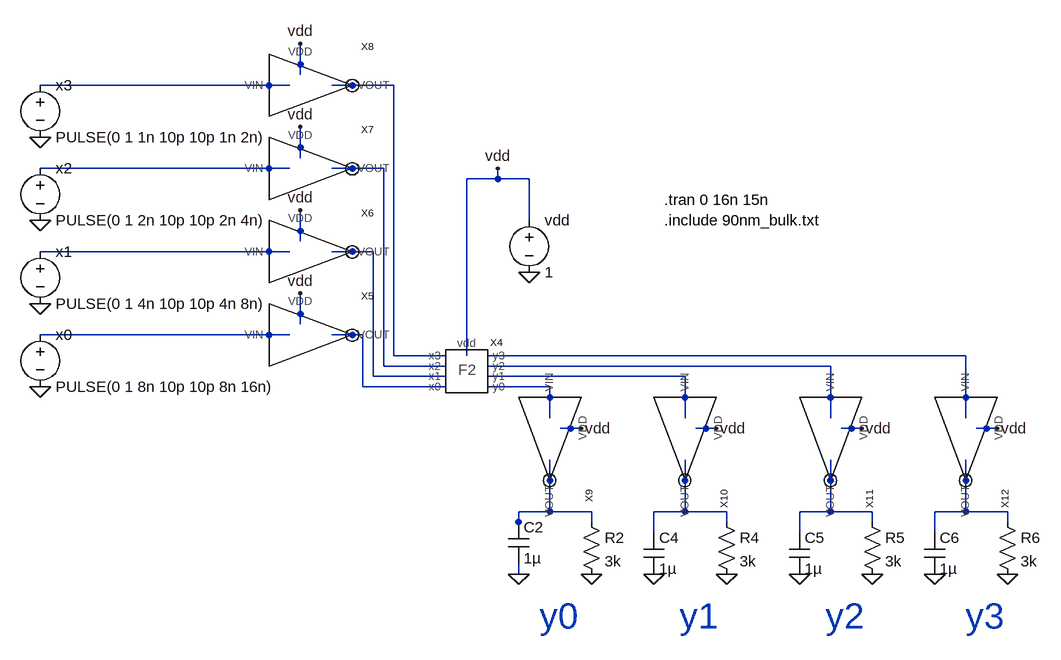
[diagram p0: schematic Formula2-test.asc]
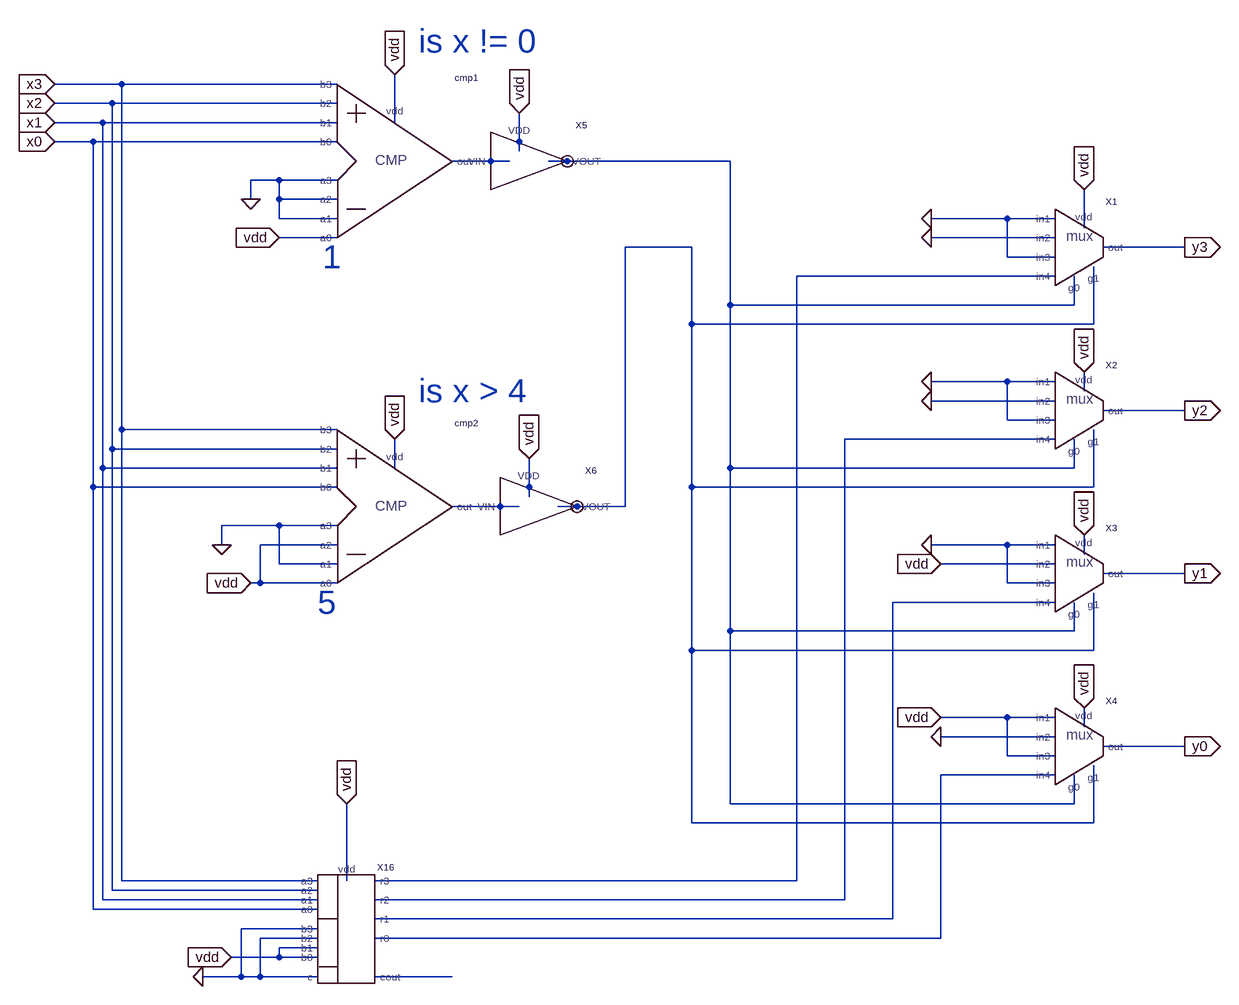
[diagram p1: sub-circuit formula2.asc]
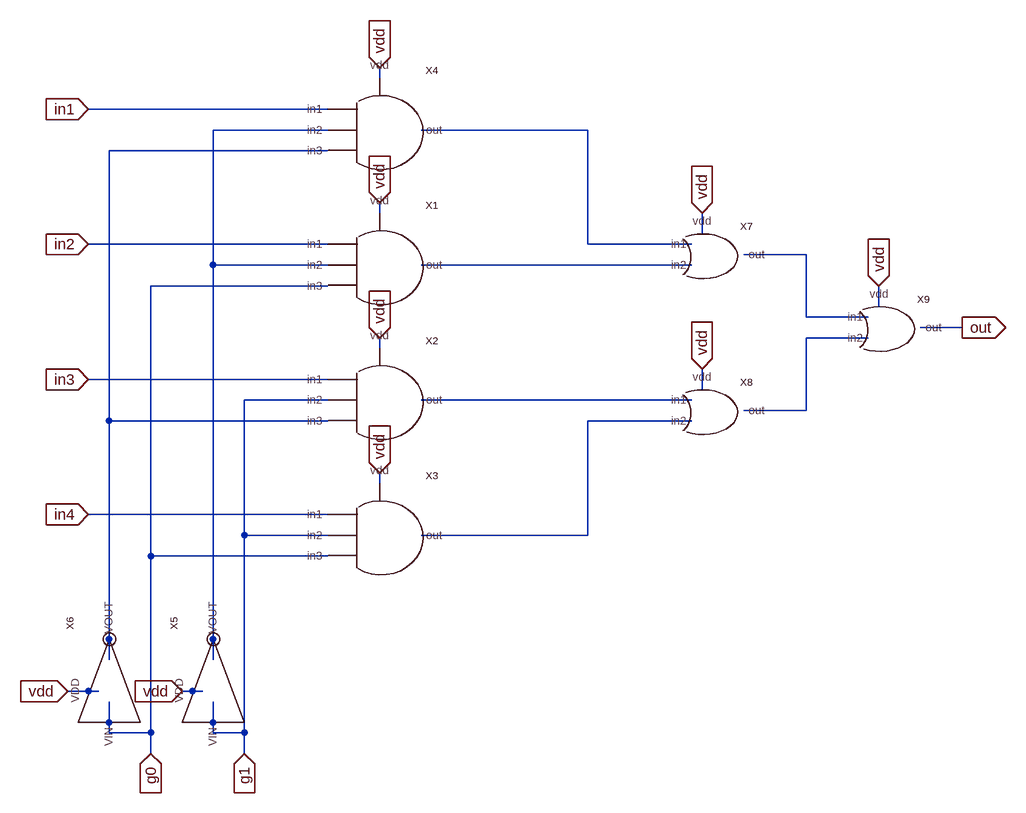
[diagram p2: sub-circuit mux4.asc]
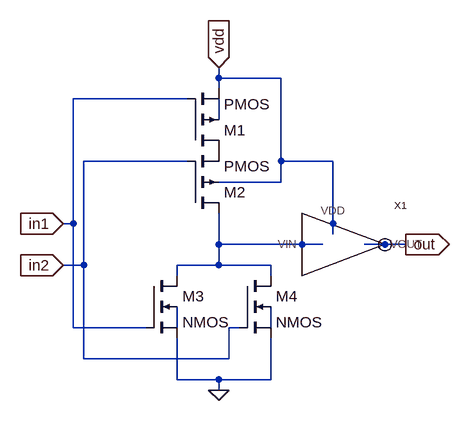
[diagram p3: sub-circuit or.asc]
Formula2-test.asc, the LTspice schematic file:
Version 4
SHEET 1 4228 1348
WIRE -112 -208 -112 -256
WIRE -128 -192 -512 -192
WIRE 32 -192 -64 -192
WIRE -112 -80 -112 -128
WIRE -128 -64 -512 -64
WIRE 16 -64 -64 -64
WIRE 192 -48 192 -64
WIRE 192 -48 144 -48
WIRE 240 -48 192 -48
WIRE 240 16 240 -48
WIRE -112 48 -112 0
WIRE -128 64 -512 64
WIRE 0 64 -64 64
WIRE -112 176 -112 128
WIRE -128 192 -512 192
WIRE -16 192 -64 192
WIRE 32 224 32 -192
WIRE 112 224 32 224
WIRE 144 224 144 -48
WIRE 912 224 176 224
WIRE 16 240 16 -64
WIRE 112 240 16 240
WIRE 704 240 176 240
WIRE 0 256 0 64
WIRE 112 256 0 256
WIRE 480 256 176 256
WIRE -16 272 -16 192
WIRE 112 272 -16 272
WIRE 272 272 176 272
WIRE 272 320 272 272
WIRE 480 320 480 256
WIRE 704 320 704 240
WIRE 912 320 912 224
WIRE 320 336 288 336
WIRE 528 336 496 336
WIRE 752 336 720 336
WIRE 960 336 928 336
WIRE 272 464 272 384
WIRE 272 464 224 464
WIRE 336 464 272 464
WIRE 480 464 480 384
WIRE 480 464 432 464
WIRE 544 464 480 464
WIRE 704 464 704 384
WIRE 704 464 656 464
WIRE 768 464 704 464
WIRE 912 464 912 384
WIRE 912 464 864 464
WIRE 976 464 912 464
WIRE 224 480 224 464
WIRE 336 480 336 464
WIRE 544 480 544 464
WIRE 768 480 768 464
WIRE 976 480 976 464
WIRE 224 496 224 480
WIRE 432 496 432 464
WIRE 656 496 656 464
WIRE 864 496 864 464
WIRE 224 560 224 544
FLAG -512 144 0
FLAG -512 272 0
FLAG -512 16 0
FLAG -512 -112 0
FLAG 224 560 0
FLAG 336 560 0
FLAG 432 560 0
FLAG 544 560 0
FLAG 656 560 0
FLAG 768 560 0
FLAG 864 560 0
FLAG 976 560 0
FLAG 240 96 0
FLAG 192 -64 vdd
FLAG -112 -256 vdd
FLAG -112 -128 vdd
FLAG -112 0 vdd
FLAG -112 128 vdd
FLAG 320 336 vdd
FLAG 528 336 vdd
FLAG 752 336 vdd
FLAG 960 336 vdd
SYMBOL voltage -512 176 R0
WINDOW 123 0 0 Left 2
WINDOW 39 0 0 Left 2
SYMATTR InstName x0
SYMATTR Value PULSE(0 1 8n 10p 10p 8n 16n)
SYMBOL voltage -512 48 R0
WINDOW 123 0 0 Left 2
WINDOW 39 0 0 Left 2
SYMATTR InstName x1
SYMATTR Value PULSE(0 1 4n 10p 10p 4n 8n)
SYMBOL voltage -512 -80 R0
WINDOW 123 0 0 Left 2
WINDOW 39 0 0 Left 2
SYMATTR InstName x2
SYMATTR Value PULSE(0 1 2n 10p 10p 2n 4n)
SYMBOL voltage -512 -208 R0
WINDOW 123 0 0 Left 2
WINDOW 39 0 0 Left 2
SYMATTR InstName x3
SYMATTR Value PULSE(0 1 1n 10p 10p 1n 2n)
SYMBOL voltage 240 0 R0
WINDOW 123 0 0 Left 2
WINDOW 39 0 0 Left 2
SYMATTR InstName vdd
SYMATTR Value 1
SYMBOL res 320 464 R0
SYMATTR InstName R2
SYMATTR Value 3k
SYMBOL cap 208 480 R0
SYMATTR InstName C2
SYMATTR Value 1µ
SYMBOL res 528 464 R0
SYMATTR InstName R4
SYMATTR Value 3k
SYMBOL cap 416 496 R0
SYMATTR InstName C4
SYMATTR Value 1µ
SYMBOL res 752 464 R0
SYMATTR InstName R5
SYMATTR Value 3k
SYMBOL cap 640 496 R0
SYMATTR InstName C5
SYMATTR Value 1µ
SYMBOL res 960 464 R0
SYMATTR InstName R6
SYMATTR Value 3k
SYMBOL cap 848 496 R0
SYMATTR InstName C6
SYMATTR Value 1µ
SYMBOL Formula2 144 240 R0
SYMATTR InstName X4
SYMBOL inverter -112 192 R0
SYMATTR InstName X5
SYMBOL inverter -112 64 R0
SYMATTR InstName X6
SYMBOL inverter -112 -64 R0
SYMATTR InstName X7
SYMBOL inverter -112 -192 R0
SYMATTR InstName X8
SYMBOL inverter 272 336 R90
SYMATTR InstName X9
SYMBOL inverter 480 336 R90
SYMATTR InstName X10
SYMBOL inverter 704 336 R90
SYMATTR InstName X11
SYMBOL inverter 912 336 R90
SYMATTR InstName X12
TEXT 448 16 Left 2 !.include 90nm_bulk.txt
TEXT 448 -16 Left 2 !.tran 0 16n 15n
TEXT 256 624 Left 5 ;y0
TEXT 472 624 Left 5 ;y1
TEXT 696 624 Left 5 ;y2
TEXT 912 624 Left 5 ;y3

formula2.asc, the sub-circuit schematic file:
Version 4
SHEET 1 880 680
WIRE -4432 -2016 -4544 -2016
WIRE -3920 -2016 -4432 -2016
WIRE -4448 -1984 -4544 -1984
WIRE -3920 -1984 -4448 -1984
WIRE -4464 -1952 -4544 -1952
WIRE -3920 -1952 -4464 -1952
WIRE -3824 -1952 -3824 -2032
WIRE -4480 -1920 -4544 -1920
WIRE -3920 -1920 -4480 -1920
WIRE -3616 -1904 -3616 -1968
WIRE -3632 -1888 -3728 -1888
WIRE -2800 -1888 -3568 -1888
WIRE -4016 -1856 -4064 -1856
WIRE -3920 -1856 -4016 -1856
WIRE -4064 -1824 -4064 -1856
WIRE -4016 -1824 -4016 -1856
WIRE -3920 -1824 -4016 -1824
WIRE -4016 -1792 -4016 -1824
WIRE -3920 -1792 -4016 -1792
WIRE -1888 -1792 -2208 -1792
WIRE -1808 -1792 -1888 -1792
WIRE -1760 -1776 -1760 -1840
WIRE -3920 -1760 -4016 -1760
WIRE -1808 -1760 -2208 -1760
WIRE -2864 -1744 -3440 -1744
WIRE -1152 -1744 -1728 -1744
WIRE -1888 -1728 -1888 -1792
WIRE -1808 -1728 -1888 -1728
WIRE -1808 -1696 -2432 -1696
WIRE -2800 -1648 -2800 -1888
WIRE -1776 -1648 -1776 -1696
WIRE -1776 -1648 -2800 -1648
WIRE -2864 -1616 -2864 -1744
WIRE -1744 -1616 -1744 -1712
WIRE -1744 -1616 -2864 -1616
WIRE -1888 -1520 -2208 -1520
WIRE -1808 -1520 -1888 -1520
WIRE -1760 -1504 -1760 -1536
WIRE -1808 -1488 -2208 -1488
WIRE -1152 -1472 -1728 -1472
WIRE -1888 -1456 -1888 -1520
WIRE -1808 -1456 -1888 -1456
WIRE -4432 -1440 -4432 -2016
WIRE -3920 -1440 -4432 -1440
WIRE -1808 -1424 -2352 -1424
WIRE -4448 -1408 -4448 -1984
WIRE -3920 -1408 -4448 -1408
WIRE -4464 -1376 -4464 -1952
WIRE -3920 -1376 -4464 -1376
WIRE -3824 -1376 -3824 -1424
WIRE -2800 -1376 -2800 -1648
WIRE -1776 -1376 -1776 -1424
WIRE -1776 -1376 -2800 -1376
WIRE -4480 -1344 -4480 -1920
WIRE -3920 -1344 -4480 -1344
WIRE -2864 -1344 -2864 -1616
WIRE -1744 -1344 -1744 -1440
WIRE -1744 -1344 -2864 -1344
WIRE -3600 -1328 -3600 -1392
WIRE -3616 -1312 -3728 -1312
WIRE -3440 -1312 -3440 -1744
WIRE -3440 -1312 -3552 -1312
WIRE -4016 -1280 -4112 -1280
WIRE -3920 -1280 -4016 -1280
WIRE -4112 -1248 -4112 -1280
WIRE -3920 -1248 -4048 -1248
WIRE -1888 -1248 -2208 -1248
WIRE -1808 -1248 -1888 -1248
WIRE -1760 -1232 -1760 -1264
WIRE -4016 -1216 -4016 -1280
WIRE -3920 -1216 -4016 -1216
WIRE -1808 -1216 -2192 -1216
WIRE -1152 -1200 -1728 -1200
WIRE -4048 -1184 -4048 -1248
WIRE -4048 -1184 -4064 -1184
WIRE -3920 -1184 -4048 -1184
WIRE -1888 -1184 -1888 -1248
WIRE -1808 -1184 -1888 -1184
WIRE -1808 -1152 -2272 -1152
WIRE -2800 -1104 -2800 -1376
WIRE -1776 -1104 -1776 -1152
WIRE -1776 -1104 -2800 -1104
WIRE -2864 -1072 -2864 -1344
WIRE -1744 -1072 -1744 -1168
WIRE -1744 -1072 -2864 -1072
WIRE -1888 -960 -2192 -960
WIRE -1808 -960 -1888 -960
WIRE -1760 -944 -1760 -976
WIRE -1808 -928 -2192 -928
WIRE -1152 -912 -1728 -912
WIRE -1888 -896 -1888 -960
WIRE -1808 -896 -1888 -896
WIRE -1808 -864 -2192 -864
WIRE -2800 -816 -2800 -1104
WIRE -1776 -816 -1776 -864
WIRE -1776 -816 -2800 -816
WIRE -2864 -784 -2864 -1072
WIRE -1744 -784 -1744 -880
WIRE -1744 -784 -2864 -784
WIRE -4432 -688 -4432 -1440
WIRE -3952 -688 -4432 -688
WIRE -3904 -688 -3904 -816
WIRE -2432 -688 -2432 -1696
WIRE -2432 -688 -3856 -688
WIRE -4448 -672 -4448 -1408
WIRE -3952 -672 -4448 -672
WIRE -4464 -656 -4464 -1376
WIRE -3952 -656 -4464 -656
WIRE -2352 -656 -2352 -1424
WIRE -2352 -656 -3856 -656
WIRE -4480 -640 -4480 -1344
WIRE -3952 -640 -4480 -640
WIRE -2272 -624 -2272 -1152
WIRE -2272 -624 -3856 -624
WIRE -3952 -608 -4080 -608
WIRE -3952 -592 -4048 -592
WIRE -2192 -592 -2192 -864
WIRE -2192 -592 -3856 -592
WIRE -3952 -576 -4016 -576
WIRE -4016 -560 -4016 -576
WIRE -4016 -560 -4096 -560
WIRE -3952 -560 -4016 -560
WIRE -4080 -528 -4080 -608
WIRE -4080 -528 -4144 -528
WIRE -4048 -528 -4048 -592
WIRE -4048 -528 -4080 -528
WIRE -3952 -528 -4048 -528
WIRE -3728 -528 -3856 -528
FLAG -4064 -1824 0
FLAG -4112 -1248 0
FLAG -4144 -528 0
FLAG -4544 -1920 x0
IOPIN -4544 -1920 In
FLAG -4544 -1952 x1
IOPIN -4544 -1952 In
FLAG -4544 -1984 x2
IOPIN -4544 -1984 In
FLAG -4544 -2016 x3
IOPIN -4544 -2016 In
FLAG -3824 -2032 vdd
IOPIN -3824 -2032 In
FLAG -4064 -1184 vdd
IOPIN -4064 -1184 In
FLAG -3904 -816 vdd
IOPIN -3904 -816 In
FLAG -4016 -1760 vdd
IOPIN -4016 -1760 In
FLAG -1152 -1744 y3
IOPIN -1152 -1744 Out
FLAG -1152 -1472 y2
IOPIN -1152 -1472 Out
FLAG -1152 -1200 y1
IOPIN -1152 -1200 Out
FLAG -1152 -912 y0
IOPIN -1152 -912 Out
FLAG -3824 -1424 vdd
IOPIN -3824 -1424 In
FLAG -4096 -560 vdd
IOPIN -4096 -560 In
FLAG -2192 -960 vdd
IOPIN -2192 -960 In
FLAG -2208 -1248 0
FLAG -2208 -1520 0
FLAG -2208 -1792 0
FLAG -2192 -1216 vdd
IOPIN -2192 -1216 In
FLAG -2192 -928 0
FLAG -2208 -1760 0
FLAG -2208 -1488 0
FLAG -3600 -1392 vdd
IOPIN -3600 -1392 In
FLAG -3616 -1968 vdd
IOPIN -3616 -1968 In
FLAG -1760 -1840 vdd
IOPIN -1760 -1840 In
FLAG -1760 -1536 vdd
IOPIN -1760 -1536 In
FLAG -1760 -1264 vdd
IOPIN -1760 -1264 In
FLAG -1760 -976 vdd
IOPIN -1760 -976 In
SYMBOL comparator -3856 -1888 R0
SYMATTR InstName cmp1
SYMBOL comparator -3856 -1312 R0
SYMATTR InstName cmp2
SYMBOL 4bitAdder -3904 -624 R0
SYMATTR InstName X16
SYMBOL mux4 -1760 -1744 R0
SYMATTR InstName X1
SYMBOL mux4 -1760 -1472 R0
SYMATTR InstName X2
SYMBOL mux4 -1760 -1200 R0
SYMATTR InstName X3
SYMBOL mux4 -1760 -912 R0
SYMATTR InstName X4
SYMBOL inverter -3616 -1888 R0
SYMATTR InstName X5
SYMBOL inverter -3600 -1312 R0
SYMATTR InstName X6
TEXT -3944 -1728 Left 5 ;1
TEXT -3952 -1152 Left 5 ;5
TEXT -3784 -2088 Left 5 ;is x != 0
TEXT -3784 -1504 Left 5 ;is x > 4

mux4.asc, the sub-circuit schematic file:
Version 4
SHEET 1 1428 876
WIRE 432 -256 432 -272
WIRE 352 -208 -16 -208
WIRE 352 -176 176 -176
WIRE 752 -176 496 -176
WIRE 352 -144 16 -144
WIRE 432 -48 432 -64
WIRE 928 -16 928 -48
WIRE 352 0 -16 0
WIRE 752 0 752 -176
WIRE 912 0 752 0
WIRE 1088 16 992 16
WIRE 176 32 176 -176
WIRE 352 32 176 32
WIRE 912 32 496 32
WIRE 352 64 80 64
WIRE 1200 96 1200 64
WIRE 1088 112 1088 16
WIRE 1184 112 1088 112
WIRE 1328 128 1264 128
WIRE 1184 144 1088 144
WIRE 432 160 432 144
WIRE 352 208 -16 208
WIRE 928 224 928 192
WIRE 352 240 224 240
WIRE 912 240 496 240
WIRE 1088 256 1088 144
WIRE 1088 256 992 256
WIRE 16 272 16 -144
WIRE 352 272 16 272
WIRE 912 272 752 272
WIRE 432 368 432 352
WIRE 352 416 -16 416
WIRE 224 448 224 240
WIRE 352 448 224 448
WIRE 752 448 752 272
WIRE 752 448 496 448
WIRE 80 480 80 64
WIRE 352 480 80 480
WIRE 16 640 16 272
WIRE 176 640 176 32
WIRE 0 688 -48 688
WIRE 160 688 128 688
WIRE 16 752 16 704
WIRE 80 752 80 480
WIRE 80 752 16 752
WIRE 176 752 176 704
WIRE 224 752 224 448
WIRE 224 752 176 752
WIRE 80 784 80 752
WIRE 224 784 224 752
FLAG -16 -208 in1
IOPIN -16 -208 In
FLAG -16 0 in2
IOPIN -16 0 In
FLAG -16 208 in3
IOPIN -16 208 In
FLAG -16 416 in4
IOPIN -16 416 In
FLAG 80 784 g0
IOPIN 80 784 In
FLAG 224 784 g1
IOPIN 224 784 In
FLAG -48 688 vdd
IOPIN -48 688 In
FLAG 128 688 vdd
IOPIN 128 688 In
FLAG 432 352 vdd
IOPIN 432 352 In
FLAG 432 144 vdd
IOPIN 432 144 In
FLAG 432 -64 vdd
IOPIN 432 -64 In
FLAG 432 -272 vdd
IOPIN 432 -272 In
FLAG 928 192 vdd
IOPIN 928 192 In
FLAG 928 -48 vdd
IOPIN 928 -48 In
FLAG 1200 64 vdd
IOPIN 1200 64 In
FLAG 1328 128 out
IOPIN 1328 128 Out
SYMBOL and3 432 32 R0
SYMATTR InstName X1
SYMBOL and3 432 240 R0
SYMATTR InstName X2
SYMBOL and3 432 -176 R0
SYMATTR InstName X4
SYMBOL inverter 176 688 R270
SYMATTR InstName X5
SYMBOL inverter 16 688 R270
SYMATTR InstName X6
SYMBOL and3 432 448 R0
SYMATTR InstName X3
SYMBOL or 928 16 R0
SYMATTR InstName X7
SYMBOL or 928 256 R0
SYMATTR InstName X8
SYMBOL or 1200 128 R0
SYMATTR InstName X9

or.asc, the sub-circuit schematic file:
Version 4
SHEET 1 880 680
WIRE 288 -128 288 -144
WIRE 384 -128 288 -128
WIRE 288 -112 288 -128
WIRE 240 -96 64 -96
WIRE 288 -64 288 -96
WIRE 240 0 80 0
WIRE 384 0 384 -128
WIRE 464 0 384 0
WIRE 384 32 384 0
WIRE 384 32 288 32
WIRE 64 96 64 -96
WIRE 64 96 48 96
WIRE 464 112 464 0
WIRE 288 128 288 80
WIRE 448 128 288 128
WIRE 576 128 512 128
WIRE 80 160 80 0
WIRE 80 160 48 160
WIRE 288 160 288 128
WIRE 288 160 224 160
WIRE 368 160 288 160
WIRE 224 176 224 160
WIRE 368 176 368 160
WIRE 64 256 64 96
WIRE 176 256 64 256
WIRE 224 256 224 224
WIRE 320 256 304 256
WIRE 368 256 368 224
WIRE 80 304 80 160
WIRE 304 304 304 256
WIRE 304 304 80 304
WIRE 224 336 224 272
WIRE 288 336 224 336
WIRE 368 336 368 272
WIRE 368 336 288 336
WIRE 288 352 288 336
FLAG 48 96 in1
IOPIN 48 96 In
FLAG 48 160 in2
IOPIN 48 160 In
FLAG 576 128 out
IOPIN 576 128 Out
FLAG 288 -144 vdd
IOPIN 288 -144 In
FLAG 288 352 0
SYMBOL pmos4 240 -16 M180
SYMATTR InstName M1
SYMATTR Value2 l=90n w=400n
SYMBOL pmos4 240 80 M180
SYMATTR InstName M2
SYMATTR Value2 l=90n w=400n
SYMBOL nmos4 176 176 R0
SYMATTR InstName M3
SYMATTR Value2 l=90n w=200n
SYMBOL nmos4 320 176 R0
SYMATTR InstName M4
SYMATTR Value2 l=90n w=200n
SYMBOL inverter 464 128 R0
SYMATTR InstName X1

The netlist it stands for:
* Formula2-test.asc
V§x0 N007 0 PULSE(0 1 8n 10p 10p 8n 16n)
V§x1 N005 0 PULSE(0 1 4n 10p 10p 4n 8n)
V§x2 N003 0 PULSE(0 1 2n 10p 10p 2n 4n)
V§x3 N001 0 PULSE(0 1 1n 10p 10p 1n 2n)
vdd vdd 0 1
R2 N013 0 3k
C2 N013 0 1µ
R4 N014 0 3k
C4 N014 0 1µ
R5 N015 0 3k
C5 N015 0 1µ
R6 N016 0 3k
C6 N016 0 1µ
XX4 N008 N006 N004 N002 vdd N012 N011 N010 N009 formula2
XX5 vdd N008 N007 inverter  ; pins VDD VOUT VIN
XX6 vdd N006 N005 inverter  ; pins VDD VOUT VIN
XX7 vdd N004 N003 inverter  ; pins VDD VOUT VIN
XX8 vdd N002 N001 inverter  ; pins VDD VOUT VIN
XX9 vdd N013 N012 inverter  ; pins VDD VOUT VIN
XX10 vdd N014 N011 inverter  ; pins VDD VOUT VIN
XX11 vdd N015 N010 inverter  ; pins VDD VOUT VIN
XX12 vdd N016 N009 inverter  ; pins VDD VOUT VIN

* block symbol definitions
.subckt formula2 x0 x1 x2 x3 vdd y0 y1 y2 y3
Xcmp1 x0 x1 x2 x3 vdd 0 0 0 vdd N001 comparator  ; pins b0 b1 b2 b3 a0 a1 a2 a3 vdd out
Xcmp2 x0 x1 x2 x3 vdd 0 vdd 0 vdd N006 comparator  ; pins b0 b1 b2 b3 a0 a1 a2 a3 vdd out
XX16 x0 x1 x2 x3 vdd vdd 0 0 0 N008 N007 N005 N004 N009 vdd 4bitAdder  ; pins a0 a1 a2 a3 b0 b1 b2 b3 c r0 r1 r2 r3 cout vdd
XX1 0 0 0 N004 y3 N002 N003 vdd mux4
XX2 0 0 0 N005 y2 N002 N003 vdd mux4
XX3 0 vdd 0 N007 y1 N002 N003 vdd mux4
XX4 vdd 0 vdd N008 y0 N002 N003 vdd mux4
XX5 vdd N002 N001 inverter  ; pins VDD VOUT VIN
XX6 vdd N003 N006 inverter  ; pins VDD VOUT VIN
* 1
* 5
* is x != 0
* is x > 4
.ends formula2

.subckt mux4 in1 in2 in3 in4 out g0 g1 vdd
XX1 in2 N001 g0 N005 vdd and3  ; pins in1 in2 in3 out vdd
XX2 in3 g1 N003 N007 vdd and3  ; pins in1 in2 in3 out vdd
XX4 in1 N001 N003 N002 vdd and3  ; pins in1 in2 in3 out vdd
XX5 vdd N001 g1 inverter  ; pins VDD VOUT VIN
XX6 vdd N003 g0 inverter  ; pins VDD VOUT VIN
XX3 in4 g1 g0 N008 vdd and3  ; pins in1 in2 in3 out vdd
XX7 N002 N005 vdd N004 or
XX8 N007 N008 vdd N006 or
XX9 N004 N006 vdd out or
.ends mux4

.subckt or in1 in2 vdd out
M1 P001 in1 vdd N001 PMOS l=90n w=400n
M2 N002 in2 P001 vdd PMOS l=90n w=400n
M3 N002 in1 0 N003 NMOS l=90n w=200n
M4 N002 in2 0 N004 NMOS l=90n w=200n
XX1 vdd out N002 inverter  ; pins VDD VOUT VIN
.ends or

.model NMOS NMOS
.model PMOS PMOS
.lib standard.mos
.include 90nm_bulk.txt
.tran 0 16n 15n
* y0
* y1
* y2
* y3
.backanno
.end